# Altium project ENCE461Tutorial.PrjPcb
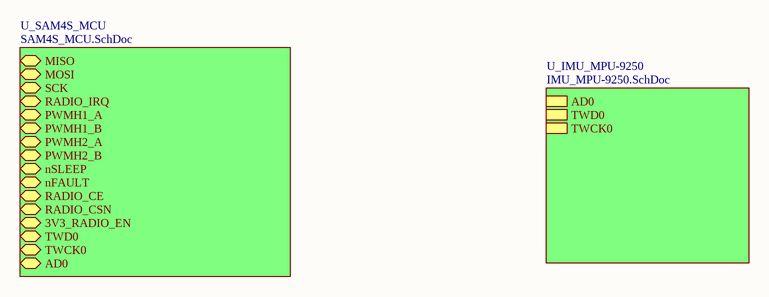
[diagram p0: Hat_Top_Level.SchDoc]
7 sheets, 101 parts. Net scope: hierarchical (ports join the sheet entries above them; power ports are global).
Sheets:
  Hat_Top_Level.SchDoc
    U_SAM4S_MCU = SAM4S_MCU.SchDoc
    U_IMU_MPU-9250 = IMU_MPU-9250.SchDoc
  Battery_and_Power.SchDoc
  Motor_Drivers.SchDoc
  Radio.SchDoc
  Joystick.SchDoc

## Sheet Hat_Top_Level.SchDoc
size A3; Address1: ECE Department; Address2: University of Canterbury; Address3: Christchurch 8041; Address4: New Zealand; Revision: 1

### Sub-sheets
U_IMU_MPU-9250 = IMU_MPU-9250.SchDoc: AD0, TWD0, TWCK0
U_SAM4S_MCU = SAM4S_MCU.SchDoc: MISO (bidir), MOSI (bidir), SCK (bidir), RADIO_IRQ (bidir), PWMH1_A (bidir), PWMH1_B (bidir), PWMH2_A (bidir), PWMH2_B (bidir), nSLEEP (bidir), nFAULT (bidir), RADIO_CE (bidir), RADIO_CSN (bidir), 3V3_RADIO_EN (bidir), TWD0 (bidir), TWCK0 (bidir), AD0 (bidir)

### Notes on the sheet
- Title
- Drawn by:
- Date:
- Time:
- Revision:
- Sheet
- of
- File:

## Sheet SAM4S_MCU.SchDoc: Wacky2020 AD19 HAT test
size A3; DrawnBy: Group 19; Address1: ECE Department; Address2: University of Canterbury; Address3: Christchurch 8041; Address4: New Zealand; Revision: 1
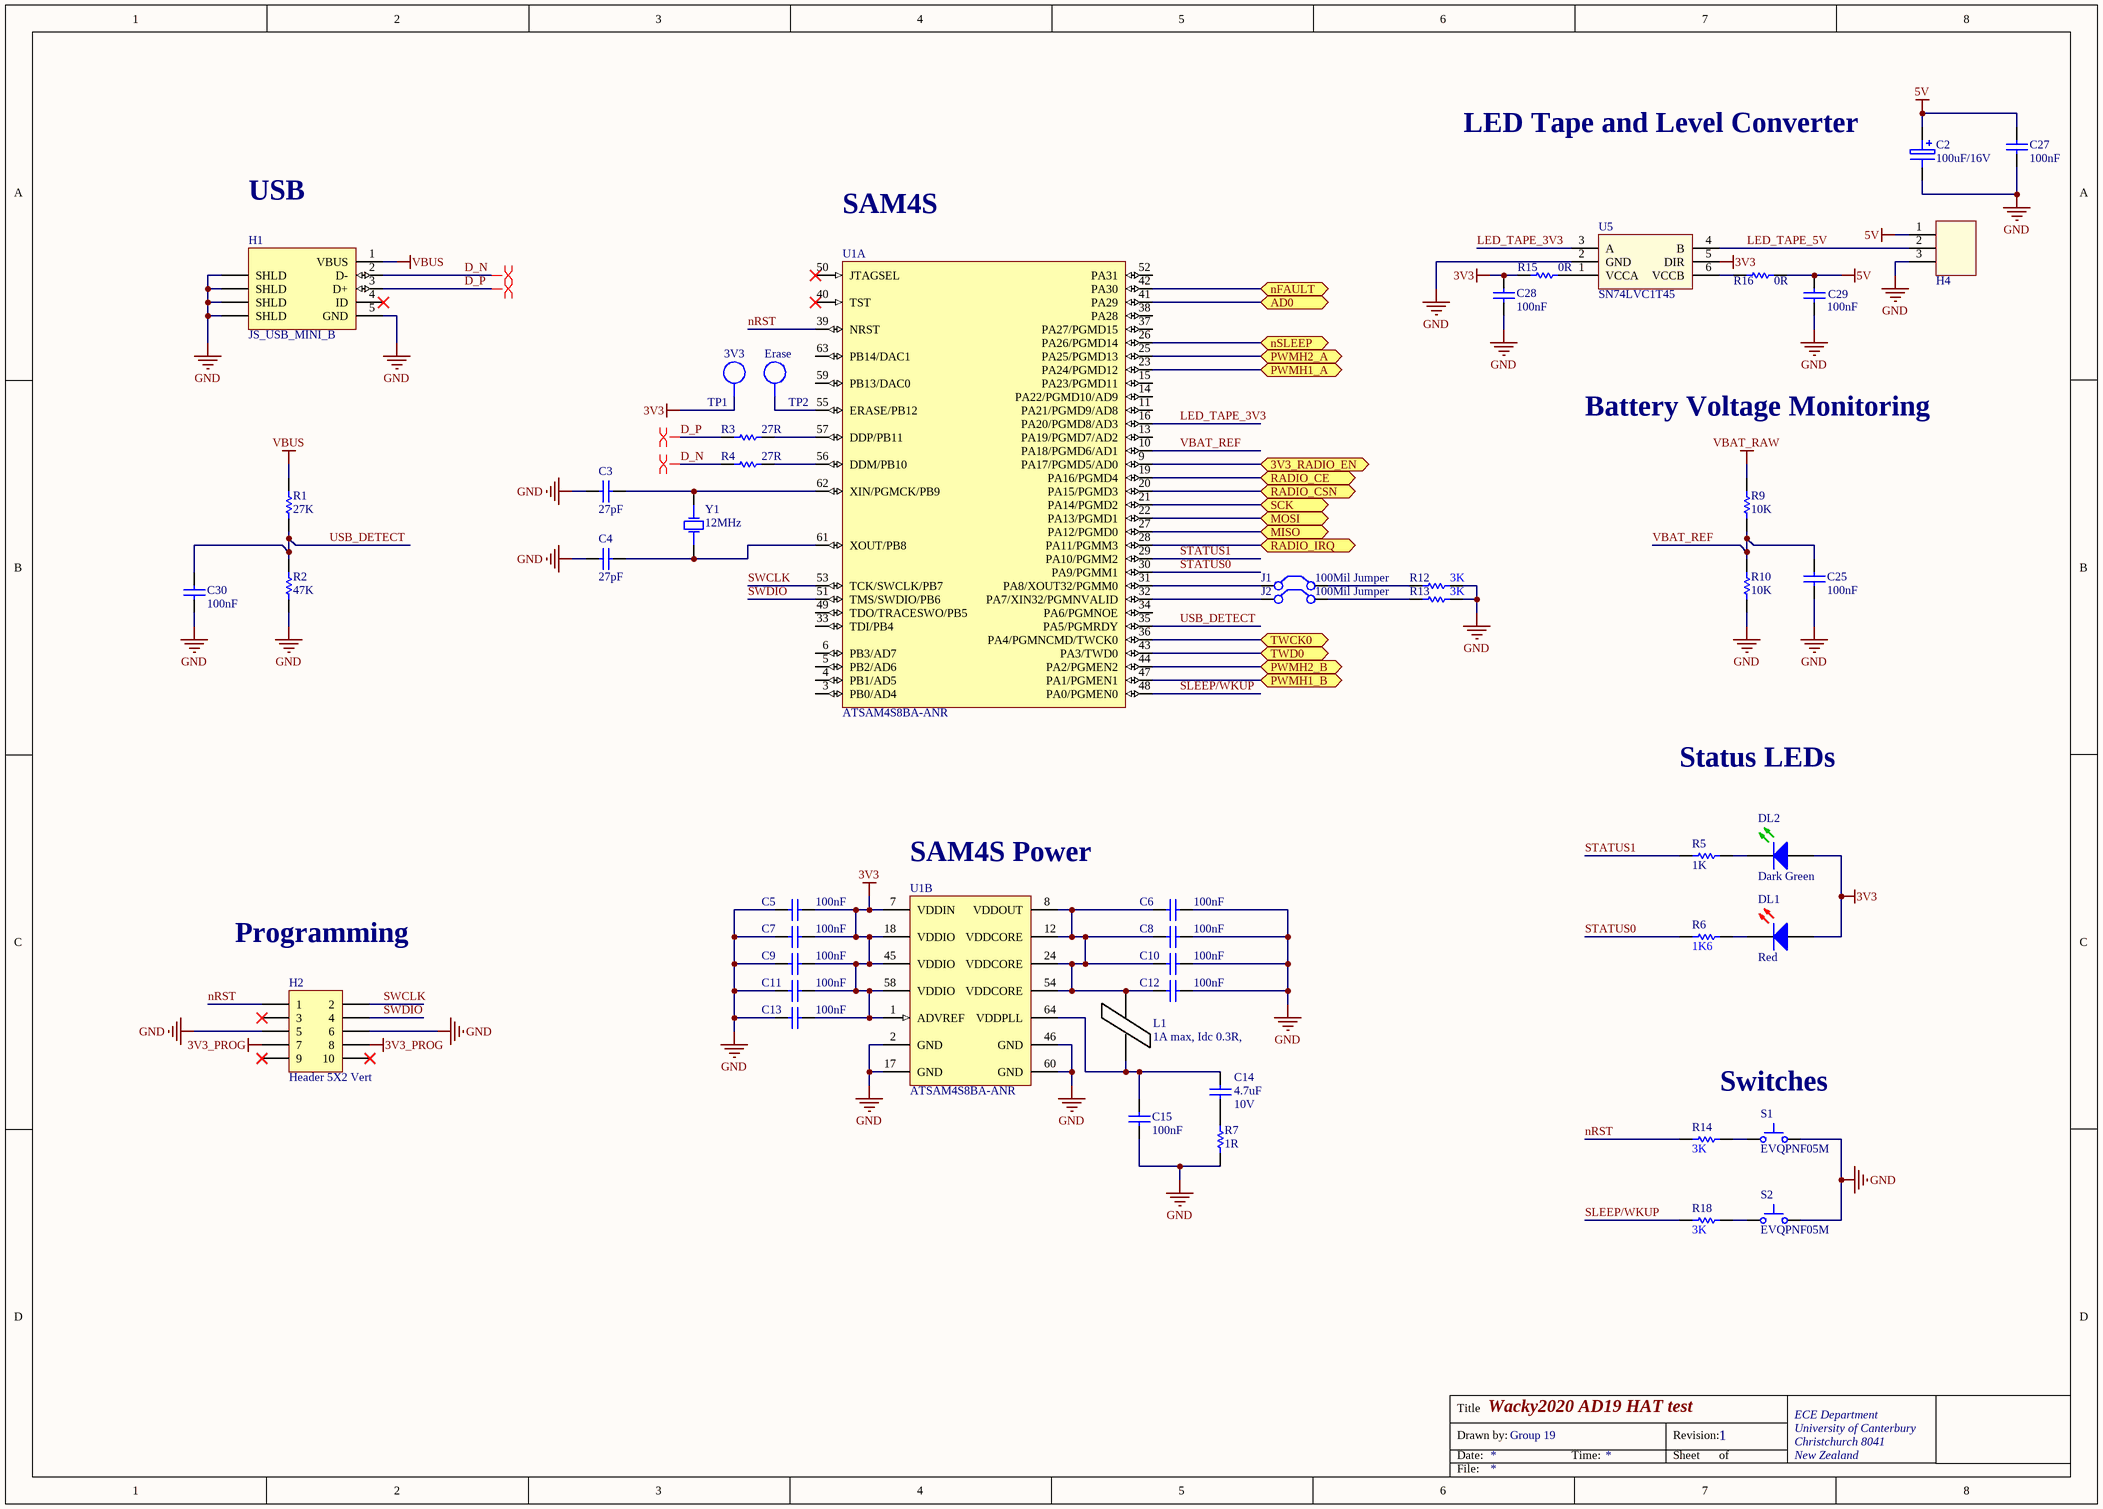
[diagram p1: SAM4S_MCU.SchDoc]

### Parts
C2  100uF/16V  [NICH-1]
C3  27pF  [CAPC1608L]
C4  27pF  [CAPC1608L]
C5  100nF  [CAPC1608L]
C6  100nF  [CAPC1608L]
C7  100nF  [CAPC1608L]
C8  100nF  [CAPC1608L]
C9  100nF  [CAPC1608L]
C10  100nF  [CAPC1608L]
C11  100nF  [CAPC1608L]
C12  100nF  [CAPC1608L]
C13  100nF  [CAPC1608L]
C14  Max Voltage: 10V  [CAPC1608N]  (hidden comment: 4.7uF)
C15  100nF  [CAPC1608L]
C25  100nF  [CAPC1608L]
C27  100nF  [CAPC1608L]
C28  100nF  [CAPC1608L]
C29  100nF  [CAPC1608L]
C30  100nF  [CAPC1608L]
DL1  Red  [WL-SMCW0603]
DL2  Dark Green  [WL-SMCW0603]
H1  JS_USB_MINI_B  [USB/SM0.8-6H5]
H2  Header 5X2 Vert  [IDC2.54-V10D]
H4  HEADER_3  [HEADER_3POS]  (value not drawn)
J1  100Mil Jumper  [JMP2.54]
J2  100Mil Jumper  [JMP2.54]
L1  1A max, Idc 0.3R,  [INDC3216L]
R1  27K  [RESC1608L]
R2  47K  [RESC1608N]
R3  27R  [RESC1608L]
R4  27R  [RESC1608L]
R5  1K  [RESC1608L]
R6  1K6  [RESC1608L]
R7  1R  [RESC3216L]
R9  10K  [RESC1608L]
R10  10K  [RESC1608L]
R12  3K  [RESC1608L]
R13  3K  [RESC1608L]
R14  3K  [RESC1608L]
R15  0R  [RESC1608L]
R16  0R  [RESC1608L]
R18  3K  [RESC1608L]
S1  EVQPNF05M  [EVQPNF05M]
S2  EVQPNF05M  [EVQPNF05M]
TP1  3V3  [TP_1206]  (no BOM)
TP2  Erase  [TP_1206]  (no BOM)
U1  ATSAM4S8BA-ANR  [LQFP64_L]  (parts A,B of 2)
U5  SN74LVC1T45  [SOT23-6_N]
Y1  12MHz  [6.0X3.5-4]

### Ports
3V3_RADIO_EN (bidir), AD0 (bidir), MISO (bidir), MOSI (bidir), nFAULT (bidir), nSLEEP (bidir), PWMH1_A (bidir), PWMH1_B (bidir), PWMH2_A (bidir), PWMH2_B (bidir), RADIO_CE (bidir), RADIO_CSN (bidir), RADIO_IRQ (bidir), SCK (bidir), TWCK0 (bidir), TWD0 (bidir)

### Nets
3V3: C5.2 C7.2 C9.2 C11.2 C13.2 C28.2 DL1.2(A) DL2.2(A) R15.1 TP1.1 U1.1(ADVREF) U1.7(VDDIN) U1.18(VDDIO) U1.45(VDDIO) U1.58(VDDIO) U5.5(DIR)
3V3_PROG: H2.7 H2.8
5V: C2.2 C27.2 C29.2 H4.1 R16.2
GND: C2.1 C3.1 C4.1 C5.1 C6.2 C7.1 C8.2 C9.1 C10.2 C11.1 C12.2 C13.1 C15.2 C25.1 C27.1 C28.1 C29.1 C30.1 H1.5(GND) H1.6(SHLD) H1.7(SHLD) H1.8(SHLD) H1.9(SHLD) H2.5 H2.6 H4.3 R2.1 R7.1 R10.1 R12.2 R13.2 S1.1 S2.1 U1.2(GND) U1.17(GND) U1.46(GND) U1.60(GND) U5.2(GND)
VBAT_RAW: R9.2
VBUS: H1.1(VBUS) R1.2
D_N: H1.2(D-) R4.1
D_P: H1.3(D+) R3.1
LED_TAPE_3V3: U1.16(PA20/PGMD8/AD3) U5.3(A)
LED_TAPE_5V: H4.2 U5.4(B)
nRST: H2.1 R14.1 U1.39(NRST)
SLEEP/WKUP: R18.1 U1.48(PA0/PGMEN0)
STATUS0: R6.1 U1.30(PA9/PGMM1)
STATUS1: R5.1 U1.29(PA10/PGMM2)
SWCLK: H2.2 U1.53(TCK/SWCLK/PB7)
SWDIO: H2.4 U1.51(TMS/SWDIO/PB6)
USB_DETECT: C30.2 R1.1 R2.2 U1.35(PA5/PGMRDY)
VBAT_REF: C25.2 R9.1 R10.2 U1.10(PA18/PGMD6/AD1)
NetC3_2: C3.2 U1.62(XIN/PGMCK/PB9) Y1.3(OSC2)
NetC4_2: C4.2 U1.61(XOUT/PB8) Y1.1(OSC1)
NetC6_1: C6.1 C8.1 C10.1 C12.1 L1.2 U1.8(VDDOUT) U1.12(VDDCORE) U1.24(VDDCORE) U1.54(VDDCORE)
NetC14_1: C14.1 R7.2
NetC14_2: C14.2 C15.1 L1.1 U1.64(VDDPLL)
NetDL1_1: DL1.1(K) R6.2
NetDL2_1: DL2.1(K) R5.2
NetJ1_1: J1.1(C1) U1.31(PA8/XOUT32/PGMM0)
NetJ1_2: J1.2(C2) R12.1
NetJ2_1: J2.1(C1) U1.32(PA7/XIN32/PGMNVALID)
NetJ2_2: J2.2(C2) R13.1
NetR3_2: R3.2 U1.57(DDP/PB11)
NetR4_2: R4.2 U1.56(DDM/PB10)
NetR14_2: R14.2 S1.2
NetR15_2: R15.2 U5.1(VCCA)
NetR16_1: R16.1 U5.6(VCCB)
NetR18_2: R18.2 S2.2
NetTP2_1: TP2.1 U1.55(ERASE/PB12)
NetU1_9: U1.9(PA17/PGMD5/AD0) ; port 3V3_RADIO_EN
NetU1_19: U1.19(PA16/PGMD4) ; port RADIO_CE
NetU1_20: U1.20(PA15/PGMD3) ; port RADIO_CSN
NetU1_21: U1.21(PA14/PGMD2) ; port SCK
NetU1_22: U1.22(PA13/PGMD1) ; port MOSI
NetU1_23: U1.23(PA24/PGMD12) ; port PWMH1_A
NetU1_25: U1.25(PA25/PGMD13) ; port PWMH2_A
NetU1_26: U1.26(PA26/PGMD14) ; port nSLEEP
NetU1_27: U1.27(PA12/PGMD0) ; port MISO
NetU1_28: U1.28(PA11/PGMM3) ; port RADIO_IRQ
NetU1_36: U1.36(PA4/PGMNCMD/TWCK0) ; port TWCK0
NetU1_41: U1.41(PA29) ; port AD0
NetU1_42: U1.42(PA30) ; port nFAULT
NetU1_43: U1.43(PA3/TWD0) ; port TWD0
NetU1_44: U1.44(PA2/PGMEN2) ; port PWMH2_B
NetU1_47: U1.47(PA1/PGMEN1) ; port PWMH1_B

Not connected (* = marked no-connect by the designer): H1 4(ID)*; H2 3* 9* 10*; U1 3(PB0/AD4) 4(PB1/AD5) 5(PB2/AD6) 6(PB3/AD7) 11(PA21/PGMD9/AD8) 13(PA19/PGMD7/AD2) 14(PA22/PGMD10/AD9) 15(PA23/PGMD11) 33(TDI/PB4) 34(PA6/PGMNOE) 37(PA27/PGMD15) 38(PA28) 40(TST)* 49(TDO/TRACESWO/PB5) 50(JTAGSEL)* 52(PA31) 59(PB13/DAC0) 63(PB14/DAC1)

### Layout directives
differential pair: D_N, D_P

### Notes on the sheet
- (near C2) LED Tape and Level Converter
- USB
- SAM4S
- Battery Voltage Monitoring
- Status LEDs
- (near U1) SAM4S Power
- Programming
- Switches
- Title
- Drawn by:
- Date:
- Time:
- Revision:
- Sheet
- of
- File:

### Library data of the parts
C2 = CA_100uF_16V: CAP ALUM 100uF 16V SMD; Manufacturer PN: UWX1C101MCL1GB; Manufacturer: Nichcon; Supplier 1: Farnell; Supplier Part Number 1: 1870677; Storage Location: PCB Assembly WS; Supplier: ECE Dept; Supplier 2: Digi-Key; Supplier Part Number 2: 493-2105-1-ND; Value: 100uF/16V
C3 C4 = CC_27pF_0603: CAP CER 27pF NPO/COG +-5% 50V 0603; PackageReference: 0603; Code_IPC: 1608 [0603]; Verify: *; Supplier: ECE Dept; Storage Location: PCB Assembly WS; Value: 27pF
C5-C13 C15 C25 C27-C30 = CC_100nF_0603: CAP CER 100nF X7R +-10% 50V 0603; PackageReference: 0603; Code_IPC: 1608 [0603]; Verify: *; Supplier: ECE Dept; Storage Location: PCB Assembly WS; Value: 100nF
C14 = CC_4.7uF_0603: CAP CER 4.7uF X5R +-20%  10V 0603; Note: Footprint corresponds to dimensions for bulk cassette packaging. This case size has tightened tolerances.; PackageReference: 0805; Code_IPC: 2012[0805]; Verify: *; Supplier: ECE Dept; Storage Location: PCB Assembly WS; Value: 4.7uF
DL1 = DL_150060RS75000: LED Red 250mcd 0603 SMD; Manufacturer: WURTH ELEKTRONIK; Forward Current If: 30; Forward Voltage: 2; Lens Shape: Rectangular; Luminous Intensity: 250; Wavelength Typ: 625; Viewing Angle: 140°; LED Mounting: SMD; Supplier 1: Farnell; Supplier Part Number 1: 2322071; Manufacturer Part Number: 150060RS75000; Storage Location: PCB Assembly WS; Supplier: ECE Dept; LED Colour: Red
DL2 = DL_150060GS75000: LED Dk Green 430mcd 0603 SMD; Manufacturer: WURTH ELEKTRONIK; Forward Current If: 30; Wavelength Typ: 520; Forward Voltage: 3.2; Lens Shape: Rectangular; Luminous Intensity: 430; Viewing Angle: 140°; LED Mounting: SMD; Supplier 1: Farnell; Supplier Part Number 1: 2322070; Manufacturer Part Number: 150060GS75000; Storage Location: PCB Assembly WS; Supplier: ECE Dept; LED Colour: Dark Green
H1 = JS_USB_MINI_B_SMT: USB 2.0, Right Angle, SMT, B Type, Receptacle, 5 Position,; Manufacturer: FCI; Manufacturer PN: 10033526-N3212MLF; Supplier 1: Farnell; Supplier Part Number 1: 1824416; Storage Location: PCB Assembly WS; Supplier: ECE Dept
H2 = JA_HDR_IDC_5X2_VERT: IDC Header, 2,54mm, 10-Pin, Vert; Supplier: ECE Dept; Supplier 1: Farnell; Supplier Part Number 1: 1096985; Storage Location: ECE Dept Store
H4 = HEADER_3: 3Pin Header 2.54mm spacing
J1 J2 = TP_JUMPER: 2.54mm Jumper Thru Hole; Pitch Spacing: 2.54; No. of Rows: 1; No. of Positions: 2; Supplier: ECE Dept; Supplier 1: Farnell; Supplier Part Number 1: 1097975; Storage Location: ECE$ Store
L1 = IN_Ferrite-Bead: Ferrite Bead, Rdc 0.3R, Z100MHZ 600R, Imax 1A, SMD 1206; Manufacturer: FAIR-RITE; Manufacturer PN: 2512066017Y1; DC Current Rating: 1; DC Resistance Max: 0.08; Ferrite Case Style: 1206 ^3216 Metric]; Frequency Range: 50MHz to 1; Impedance: 600; Impedance Tolerance: ± 25%; Supplier: ECE Dept; Storage Location: PCB Assembly WS; Ferrite Mounting: SMD; Supplier 1: Farnell; Supplier Part Number 1: 1612060; Manufacturer Part Number: 2512066017Y1; Value: 1A max, Idc 0.3R,
R1 = RS_27K: RES 27K OHM 1/10W 5% 0603 SMD; Storage Location: PCB Assembly WS; Supplier: ECE Dept; Value: 27K
R2 = RS_47K: RES 47.0K OHM 1/10W 5% 0603 SMD; Storage Location: PCB Assembly WS; Supplier: ECE Dept; Value: 47K
R3 R4 = RS_27R: RES 27 OHM 1/10W 5% 0603 SMD; Storage Location: PCB Assembly WS; Supplier: ECE Dept; Value: 27R
R5 = RS_1K: RES 1.0K OHM 1/10W 5% 0603 SMD; Storage Location: PCB Assembly WS; Supplier: ECE Dept; Value: 1K
R6 = RS_1K6: RES 1.6K OHM 1/10W 5% 0603 SMD; Storage Location: PCB Assembly WS; Supplier: ECE Dept; Value: 1K6
R7 = RT_1R: RES 1R OHM 1/4W 5% 1206 SMD; Storage Location: PCB Assembly WS; Supplier: ECE Dept; Value: 1R
R9 R10 = RS_10K: RES 10.0K OHM 1/10W 5% 0603 SMD; Storage Location: PCB Assembly WS; Supplier: ECE Dept; Value: 10K
R12-R14 R18 = RS_3K: RES 3K OHM 1/10W 5% 0603 SMD; Storage Location: PCB Assembly WS; Supplier: ECE Dept; Value: 3K
R15 R16 = RS_0R0: RES 0.0 OHM 1/10W 5% 0603 SMD; Storage Location: PCB Assembly WS; Supplier: ECE Dept; Value: 0R
S1 S2 = WS_EVQPNF05M: Panasonic 6 x 3.5mm SMD Light Touch Switch Type SMD; PackageDescription: 6.0 x 3.5 mm; Supplier 1: Farnell; Supplier Part Number 1: 2079481; Manufacturer: Panasonic; Manufacturer PN: EVQPNF05M; Supplier 2: Digi-Key; Supplier Part Number 2: P13598SCT-ND; Storage Location: PCB Assembly WS; Supplier: ECE Dept
TP1 TP2 = TP_1206: Test-Point 3.3x1.6x2.1mm SMD; Manufacturer: Harwin Inc; Manufacturer Part Number: S1751-46R; Value: TP; Manufacturer PN: *; Storage Location: ProtoPlace; Mounting Type: Surface Mount; Type: PC Test Point; Supplier 1: Digi-Key; Supplier Part Number 1: 952-1478-2-ND; Supplier 2: Farnell; Supplier Part Number 2: 1826282; Supplier: ECE Dept
U1 = SE_ATSAM4S16BA-MU: IC MCU 32BIT 512KB FLASH 64LQFP; Manufacturer: Atmel; Connectivity: I²C, IrDA, Memory Card, SPI, SSC, UART/USART, USB; Core Processor: ARM® Cortex®-M4; Core Size: 32-Bit; Data Converters: A/D 11x12b, D/A 2x12b; Number of I/O: 47; Peripherals: Brown-out Detect/Reset, DMA, POR, PWM, WDT; Program Memory Size: 512KB (512K x 8); RAM Size: 128K x 8; Speed: 120MHz; Voltage - Supply (Vcc/Vdd): 1.62 V ~ 3.6 V; PackageVersion: revJ, Jul-2007; PackageReference: 64PS; PackageDescription: 64-Pin Quad Flat No-Lead (QFN) Sawn, 9 x 9 x 1.0 mm Body, 0.5 mm Pitch, Exposed Pad; Code_JEDEC: MO-220VMMD-3; ComponentLink1Description: Manufacturer URL; ComponentLink1URL: http://www.atmel.com/; ComponentLink2Description: SAM4S Series Datasheet; ComponentLink2URL: http://www.atmel.com/dyn/resources/prod_documents/11100.pdf; ComponentLink3Description: SAM4S Series Summary; ComponentLink3URL: http://www.atmel.com/dyn/resources/prod_documents/11100S.pdf; Supplier 1: Digi-Key; Package / Case: 64-LQFP; Packaging: Cut Tape (CT); Program Memory Type: FLASH; Supplier Part Number 1: ATSAM4S8BA-ANRCT-ND; Manufacturer Part Number: ATSAM4S8BA-ANR
U5 = SN74LVC1T45: 1.8V - 5V level converter
Y1 = XT_CRYSTAL_12MHz_18pF: CRYSTAL 12MHZ 18PF 6X3.5mm SMD; Manufacturer: CTS-Frequency Controls; Manufacturer Part Number: 406C35D12M00000; ESR (Equivalent Series Resistance): 60 Ohm; Frequency Stability: ±50ppm; Frequency Tolerance: ±30ppm; Operating Mode: Fundamental; Supplier 1: Digi-Key; Height: 0.047" (1.20mm); Load Capacitance: 18pF; Mounting Type: Surface Mount; Operating Temperature: -20°C ~ 70°C; Package / Case: 4-SMD, No Lead (DFN, LCC); Size / Dimension: 0.236" L x 0.138" W (6.00mm x 3.50mm); Supplier Part Number 1: CTX855CT-ND; Frequency: 12MHz

## Sheet IMU_MPU-9250.SchDoc
size A3; Author: Group 19; Address1: ECE Department; Address2: University of Canterbury; Address3: Christchurch 8041; Address4: New Zealand; Revision: 1
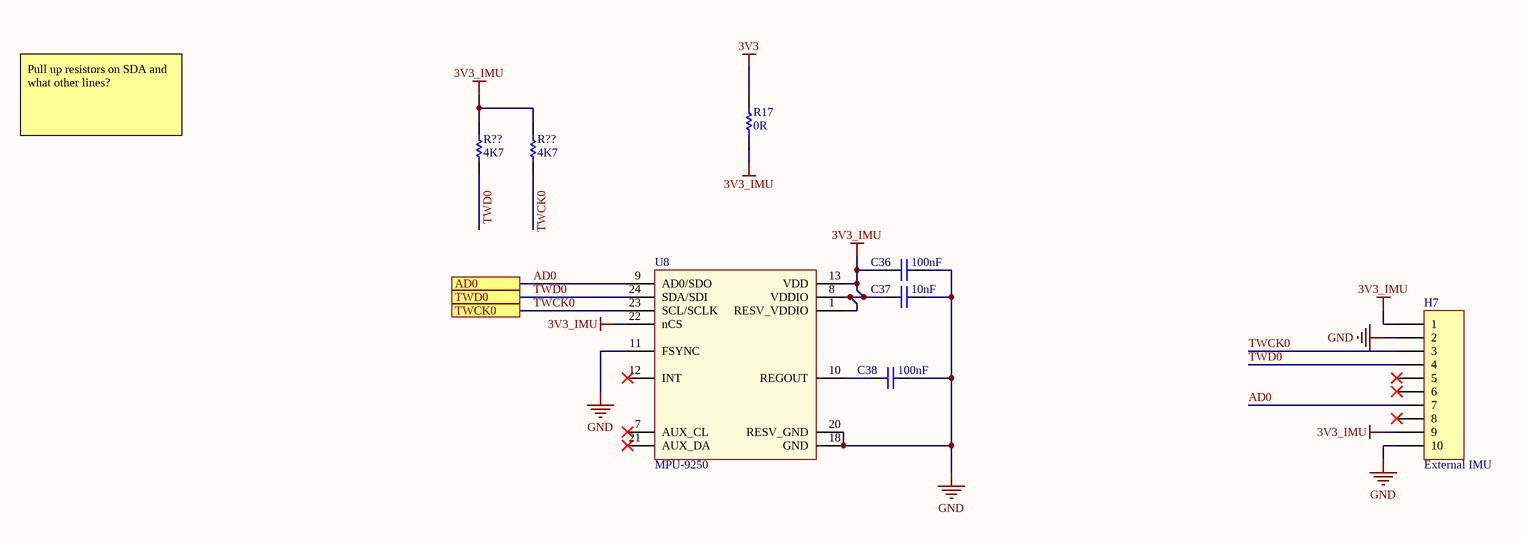
[diagram p2: IMU_MPU-9250.SchDoc]

### Parts
(Parts that share a designator on the sheet are numbered #1, #2 ... from top to bottom, then left to right.)
C36  100nF  [CAPC1608L]
C37  10nF  [CAPC1608L]
C38  100nF  [CAPC1608L]
H7  External IMU  [MOLEX_KK_10_HDR]
R17  0R  [RESC1608L]
R??#1  4K7  [RESC1608L]
R??#2  4K7  [RESC1608L]
U8  MPU-9250  [Quad24]

### Ports
AD0, TWCK0, TWD0

### Nets
3V3: R17.2
3V3_IMU: C36.1 C37.1 H7.1 H7.9 R17.1 R??#1.2 R??#2.2 U8.1(RESV_VDDIO) U8.8(VDDIO) U8.13(VDD) U8.22(nCS)
GND: C36.2 C37.2 C38.1 H7.2 H7.10 U8.11(FSYNC) U8.18(GND) U8.20(RESV_GND)
AD0: H7.7 U8.9(AD0/SDO) ; port AD0
TWCK0: H7.3 R??#2.1 U8.23(SCL/SCLK) ; port TWCK0
TWD0: H7.4 R??#1.1 U8.24(SDA/SDI) ; port TWD0
NetC38_2: C38.2 U8.10(REGOUT)

Not connected (* = marked no-connect by the designer): H7 5* 6* 8*; U8 7(AUX_CL)* 12(INT)* 21(AUX_DA)*

### Notes on the sheet
- Pull up resistors on SDA and what other lines?
- Title
- Drawn by:
- Date:
- Time:
- Revision:
- Sheet
- of
- File:

### Library data of the parts
C36 C38 = CC_100nF_0603: CAP CER 100nF X7R +-10% 50V 0603; PackageReference: 0603; Code_IPC: 1608 [0603]; Verify: *; Supplier: ECE Dept; Storage Location: PCB Assembly WS; Value: 100nF
C37 = CC_10nF_0603: CAP CER 10nF X7R +-10% 50V 0603; PackageReference: 0603; Code_IPC: 1608 [0603]; Verify: *; Supplier: ECE Dept; Storage Location: PCB Assembly WS; Value: 10nF
H7 = JA_MOLEX_KK_10POS: CONN HEADER 10POS 2.54mm VERT_ Thru Hole; Supplier 1: Farnell; Supplier Part Number 1: 1756828; Supplier: ECE Dept; Storage Location: ECE Dept Store; Value: External IMU
R17 = RS_0R0: RES 0.0 OHM 1/10W 5% 0603 SMD; Storage Location: PCB Assembly WS; Supplier: ECE Dept; Value: 0R
R??#1 R??#2 = RS_4K7: RES 4.7K OHM 1/10W 5% 0603 SMD; Storage Location: PCB Assembly WS; Supplier: ECE Dept; Value: 4K7
U8 = MPU-9250: 9 axis IMU

## Sheet Battery_and_Power.SchDoc
size A3; Address1: ECE Department; Address2: University of Canterbury; Address3: Christchurch 8041; Address4: New Zealand; Revision: 1
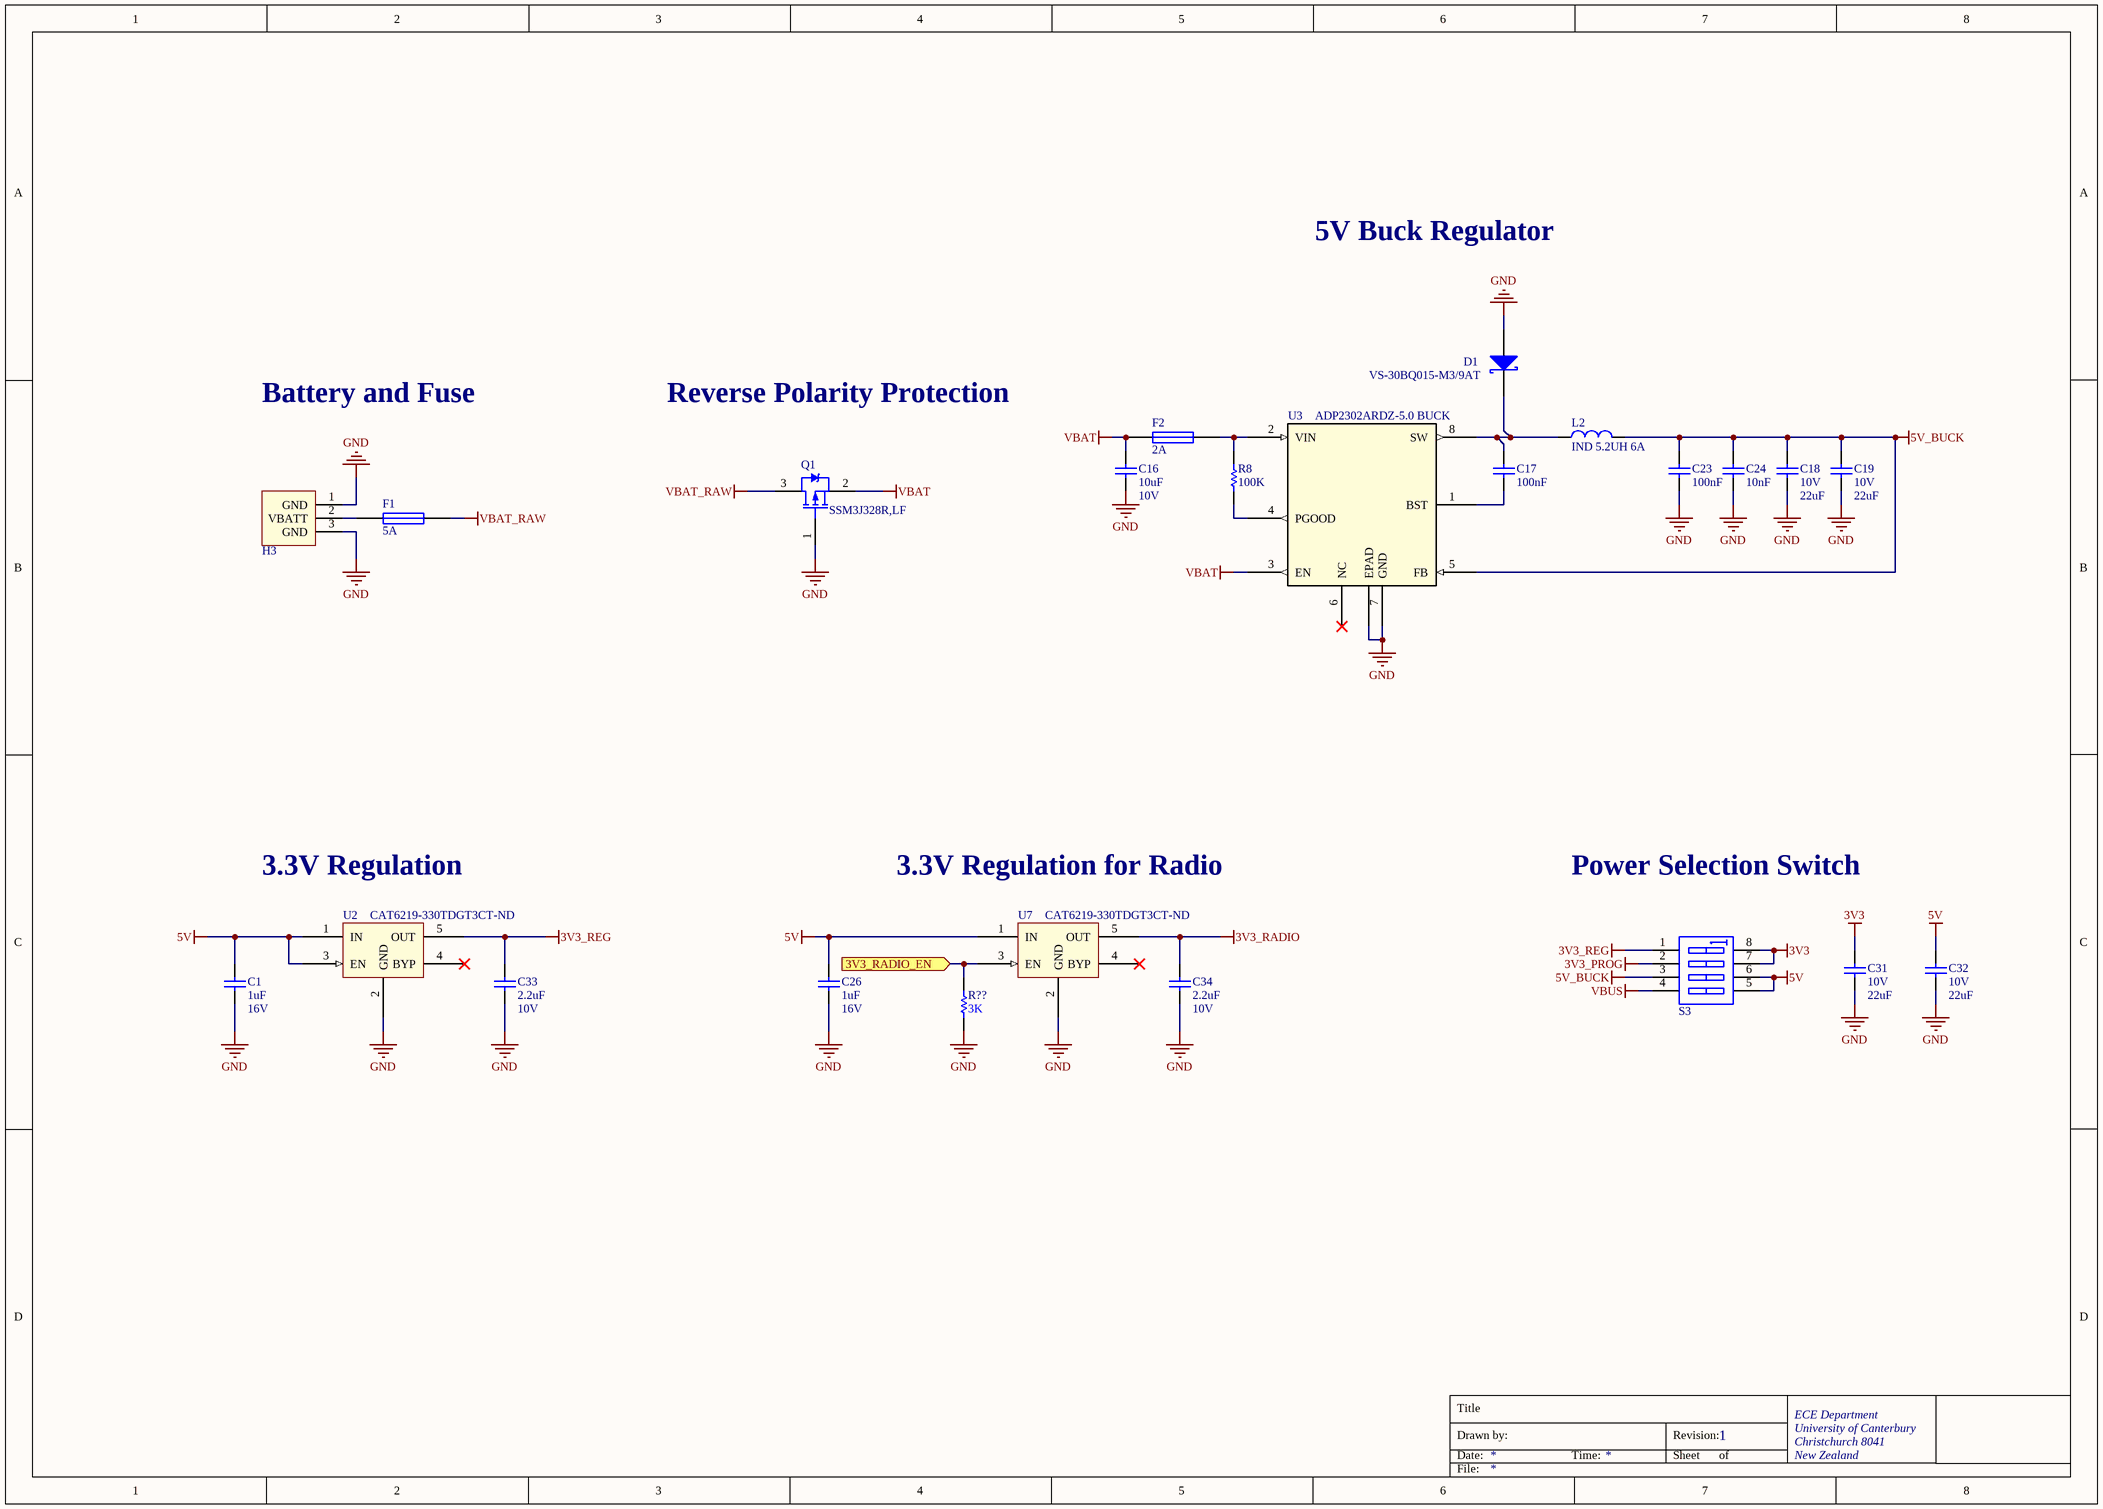
[diagram p3: Battery_and_Power.SchDoc]

### Parts
(Parts that share a designator on the sheet are numbered #1, #2 ... from top to bottom, then left to right.)
C1  Max Voltage: 16V  [CAPC1608L]  (hidden comment: 1uF)
C16  Max Voltage: 10V  [CAPC2012L]  (hidden comment: 10uF)
C17  100nF  [CAPC1608L]
C18  Max Voltage: 10V  [CAPC3216L]  (hidden comment: 22uF)
C19  Max Voltage: 10V  [CAPC3216L]  (hidden comment: 22uF)
C23  100nF  [CAPC1608L]
C24  10nF  [CAPC1608L]
C26  Max Voltage: 16V  [CAPC1608L]  (hidden comment: 1uF)
C31  Max Voltage: 10V  [CAPC3216L]  (hidden comment: 22uF)
C32  Max Voltage: 10V  [CAPC3216L]  (hidden comment: 22uF)
C33  Max Voltage: 10V  [CAPC1608L]  (hidden comment: 2.2uF)
C34  Max Voltage: 10V  [CAPC1608L]  (hidden comment: 2.2uF)
D1  VS-30BQ015-M3/9AT  [SMC]
F1  5A  [RESC3216N]
F2  2A  [RESC3216N]
H3  Battery_HEADER_3pin  [BATT_HEADER_3POS]  (value not drawn)
L2  IND 5.2UH 6A  [INDUCTOR5u2]
Q1  SSM3J328R,LF  [SOT23_L]
R8  100K  [RESC1608L]
R??#3  3K  [RESC1608L]
S3  WS_SW DIP-4  [DIP_SW_4WAY_SMD -]  (value not drawn)
U2  Supplier Part Number: CAT6219-330TDGT3CT-ND  [SOT95P280X145-5N]  (hidden comment: CAT6219-330TDGT3)
U3  ADP2302ARDZ-5.0 BUCK  [RD_8_1]
U7  Supplier Part Number: CAT6219-330TDGT3CT-ND  [SOT95P280X145-5N]  (hidden comment: CAT6219-330TDGT3)

### Ports
3V3_RADIO_EN (in)

### Nets
3V3: C31.2 S3.7(B2) S3.8(B1)
3V3_PROG: S3.2(A2)
3V3_RADIO: C34.2 U7.5(OUT)
3V3_REG: C33.2 S3.1(A1) U2.5(OUT)
5V: C1.2 C26.2 C32.2 S3.5(B4) S3.6(B3) U2.1(IN) U2.3(EN) U7.1(IN)
5V_BUCK: C18.2 C19.2 C23.2 C24.2 L2.2 S3.3(A3) U3.5(FB)
GND: C1.1 C16.1 C18.1 C19.1 C23.1 C24.1 C26.1 C31.1 C32.1 C33.1 C34.1 D1.1(A) H3.1(GND) H3.3(GND) Q1.1 R??#3.1 U2.2(GND) U3.7(GND) U3.EPAD U7.2(GND)
VBAT: C16.2 F2.1 Q1.2 U3.3(EN)
VBAT_RAW: F1.2 Q1.3
VBUS: S3.4(A4)
NetC17_1: C17.1 U3.1(BST)
NetC17_2: C17.2 D1.2(K) L2.1 U3.8(SW)
NetF1_1: F1.1 H3.2(VBATT)
NetF2_2: F2.2 R8.2 U3.2(VIN)
NetR8_1: R8.1 U3.4(PGOOD)
NetR??#3_2: R??#3.2 U7.3(EN) ; port 3V3_RADIO_EN

Not connected (* = marked no-connect by the designer): U2 4(BYP)*; U3 6(NC)*; U7 4(BYP)*

### Notes on the sheet
- 5V Buck Regulator
- Battery and Fuse
- Reverse Polarity Protection
- 3.3V Regulation
- 3.3V Regulation for Radio
- Power Selection Switch
- Title
- Drawn by:
- Date:
- Time:
- Revision:
- Sheet
- of
- File:

### Library data of the parts
C1 C26 = CC_1uF_0603: CAP CER 1uF Y5V -20% +80% 16V 0603; PackageReference: 0603; Code_IPC: 1608 [0603]; Verify: *; Supplier: ECE Dept; Storage Location: PCB Assembly WS; Value: 1uF
C16 = CC_10uF_0805_10V: CAP CER 10uF X7R +-20% 10V 0805; Note: Footprint corresponds to dimensions for bulk cassette packaging. This case size has tightened tolerances.; PackageReference: 0805; Code_IPC: 2012[0805]; Verify: *; Supplier: ECE Dept; Storage Location: PCB Assembly WS; Value: 10uF
C17 C23 = CC_100nF_0603: CAP CER 100nF X7R +-10% 50V 0603; PackageReference: 0603; Code_IPC: 1608 [0603]; Verify: *; Supplier: ECE Dept; Storage Location: PCB Assembly WS; Value: 100nF
C18 C19 C31 C32 = CC_22uF_1206: CAP CER 22uF Y5V -20% +80% 10V 1206; Verify: *; Supplier: ECE Dept; Storage Location: PCB Assembly WS; Dielectric: Y5V; Footprint: 1206 (3216 metric); Value: 22uF
C24 = CC_10nF_0603: CAP CER 10nF X7R +-10% 50V 0603; PackageReference: 0603; Code_IPC: 1608 [0603]; Verify: *; Supplier: ECE Dept; Storage Location: PCB Assembly WS; Value: 10nF
C33 C34 = CC_2.2uF_0603: CAP CER 2.2uF X5R +-20% 10V 0603; PackageReference: 0603; Code_IPC: 1608 [0603]; Verify: *; Supplier: ECE Dept; Storage Location: PCB Assembly WS; Value: 2.2uF
D1 = DS_VS-30BQ015-M3: DIODE, SCHOTTKY, 3A, 15V, DO-214AB / SMC; Manufacturer: Vishay Semiconductors; Forward Voltage: 350mV; Max Forward Surge Current (Ifsm): 650A; Peak Reverse Current: 4mA; Average Rectified Current: 3A; Max Reverse Voltage (DC): 15V; Supplier: Digi-Key; ComponentLink1URL: https://datasheet.ciiva.com/36181/vs-30bq015-m3-9at-36181258.pdf; ComponentLink1Description: https://datasheet.ciiva.com/36181/vs-30bq015-m3-9at-36181258.pdf; Supplier 1: Digi-Key; Supplier 2: Element14; Supplier Part Number 1: VS-30BQ015-M3/9ATGIDKR-ND; Supplier Part Number 2: 2628288; Supplier Part Number: VS-30BQ015-M3/9AT-ND; Manufacturer Part Number: VS-30BQ015-M3/9AT
F1 = FS_Fuse_5.0A: Fuse 5.0A Fast Acting 1206 SMD; Manufacturer Part Number: C1F5; Manufacturer: Bel TRP; Voltage Rating (AC): 125V; Voltage Rating (DC): 63V; DC Cold Resistance: 19mR; Fuse Type: Board Mount (Cartridge Style Excluded); Approvals: CE,cURus; Mount: Surface Mount; Case/Package: 1206; Number of Pins: 2; Case Code (Metric): 3216; Case Code (Imperial): 1206; Contact Plating: Nickel,Tin; Min Operating Temperature: -55°C; Max Operating Temperature: 125°C; Packaging: Tape and Reel; Voltage Rating: 125V; Length: 0.126inch; Width: 0.062inch; Supplier 1: Digi-Key; Stock 1: 725; Pricing 1: 1=0.32, 5=0.312, 10=0.298, 50=0.2662, 100=0.2479, 250=0.22032, 500=0.1836, 1000=0.17442 (USD); ComponentLink1URL: http://www.farnell.com/datasheets/2571625.pdf; ComponentLink1Description: http://www.farnell.com/datasheets/2571625.pdf; ComponentLink2URL: http://belfuse.com/pdfs/C1F.pdf; ComponentLink2Description: http://belfuse.com/pdfs/C1F.pdf; ComponentLink3URL: http://www.mouser.com/ds/2/643/C1F-594910.pdf; ComponentLink3Description: http://www.mouser.com/ds/2/643/C1F-594910.pdf; ComponentLink4URL: https://belfuse.com/resources/StewartConnector/C1F.pdf; ComponentLink4Description: https://belfuse.com/resources/StewartConnector/C1F.pdf; Current Rating: 5A; Supplier Part Number 1: 507-1886-1-ND; Supplier 2: Element14; Supplier Part Number 2: 2848595; Value: 5A
F2 = FS_Fuse_2.0A: Fuse 2.0A Very Fast Acting 1206 SMD; Manufacturer: MULTICOMP; Manufacturer PN: MC12CF 002; Supplier: ECE Dept; Storage Location: PCB Assembly WS; Supplier 1: Farnell; Supplier Part Number 1: 1841029; Manufacturer Part Number: MC12CF 002; Value: 2A
H3 = Battery_HEADER_3pin: 3Pin Header 2.54mm spacing
L2 = CDRH104RNP-5R2NC: FIXED IND 5.2UH 6A 22 MOHM SMD; Manufacturer: Sumida America Components Inc.; Material - Core: Ferrite; Tolerance: ±30%; Current - Saturation: 5.6A; Shielding: Shielded; DC Resistance (DCR): 22 mOhm Max; Supplier 1: Digi-Key; Manufacturer Part Number: CDRH104RNP-5R2NC; RoHS: RoHS Compliant; Category: Inductors, Coils, Chokes; Stock 1: 3849; Pricing 1: 1=2.9, 10=2.678, 100=1.8743, 500=1.5173 (NZD); Packaging: Cut Tape (CT); Part Status: Active; Type: -; Q @ Freq: -; Frequency - Self Resonant: -; Ratings: -; Operating Temperature: -40°C ~ 100°C; Mounting Type: Surface Mount; Package / Case: Nonstandard; Supplier Device Package: -; Size / Dimension: 0.402" L x 0.394" W (10.20mm x 10.00mm); Height - Seated (Max): 0.157" (4.00mm); ComponentLink1URL: http://products.sumida.com/products/pdf/CDRH104R.pdf; ComponentLink1Description: http://products.sumida.com/products/pdf/CDRH104R.pdf; Supplier Part Number 1: 308-2280-1-ND
Q1 = TM_SSM3J328R: MOSFET P-CH 20V 6A SOT23-3; Manufacturer: Toshiba; FET Feature: Logic Level Gate, 1.5V Drive; FET Type: MOSFET P-Channel, Metal Oxide; Gate Charge (Qg) @ Vgs: 12.8nC @ 4.5V; Input Capacitance (Ciss) @ Vds: 840pF @ 10V; Power - Max: 1W; Rds On Max: 29.8mR; Drain to Source Resistance: 47.4mR; Turn-On Delay Time: 32ns; Power Dissipation: 2W; Number of Channels: 1; Turn-Off Delay Time: 107ns; Gate to Source Voltage (Vgs): 8V; Input Capacitance: 840pF; Element Configuration: Single; Drain to Source Breakdown Voltage: -20V; Vgs(th) (Max) @ Id: 1V @ 1mA; Current - Continuous Drain (Id) @ 25° C: 6A; Drain to Source Voltage (Vdss): 20V; Package / Case: SOT-23-3 Flat Leads; Supplier Device Package: SOT-23F; Pricing: 1=0.79, 10=0.658, 25=0.5772, 100=0.4939, 250=0.42836, 500=0.36284, 1000=0.27972 (NZD); Storage Location: PCB Assembly WS; Supplier: Digi-Key; ComponentLink1URL: https://datasheet.ciiva.com/11158/ssm3j328r-datasheet-en-20140301-11158652.pdf; ComponentLink1Description: https://datasheet.ciiva.com/11158/ssm3j328r-datasheet-en-20140301-11158652.pdf; Supplier Part Number: SSM3J328RLFDKR-ND; Max Operating Temperature: 150°C; Mount: Surface Mount; Packaging: Tape and Reel; Min Operating Temperature: -55°C; Continuous Drain Current (ID): 6A; Radiation Hardening: No; Max Power Dissipation: 1W; Package Quantity: 3000; Case/Package: SOT-23-3; Number of Pins: 3; Number of Elements: 1; Supplier 1: Digi-Key; Supplier Part Number 1: SSM3J328RLFDKR-ND; Manufacturer Part Number: SSM3J328R,LF
R8 = RS_100K: RES 100K OHM 1/10W 5% 0603 SMD; Storage Location: PCB Assembly WS; Supplier: ECE Dept; Value: 100K
R??#3 = RS_3K: RES 3K OHM 1/10W 5% 0603 SMD; Storage Location: PCB Assembly WS; Supplier: ECE Dept; Value: 3K
S3 = WS_SW DIP-4: DIP Switch, 4 Position, SPST SMD; Manufacturer: OMRON ELECTRONIC COMPONENTS; Manufacturer Part Number: A6SN-4101; Contact Current DC Max: 25; External Length / Height: 12.1; No. of Switch Positions: 4; Pitch Spacing: 2.54; Contact Configuration: SPST; Supplier 1: Farnell; Supplier Part Number 1: 2029425; Storage Location: PCB Assembly WS; Supplier: ECE Dept
U2 U7 = SV_CAT6219-330TDGT3: IC REG LIN 3.3V 500MA TSOT23-5; Voltage - Input (Max): 5.5V; Voltage Dropout (Max): 0.5V @ 500mA; Manufacturer Part Number: CAT6219-330TDGT3; Base Part Number: CAT6219; Current - Output: 500mA; Package / Case: SOT-23-5 Thin, TSOT-23-5; Supplier: Digi-Key; Supplier Device Package: TSOT-23-5; Voltage - Output (Min/Fixed): 3.3V; ComponentLink1URL: http://www.onsemi.com/pub/Collateral/CAT6219-D.PDF; ComponentLink1Description: http://www.onsemi.com/pub/Collateral/CAT6219-D.PDF; Supplier 1: Digi-Key
U3 = ADP2302ARDZ-5.0-R7: IC REG BUCK 5V 2A 8SOIC; Vendor: Analog Devices Inc; Frequency - Switching: 700kHz; Output Type: Fixed; Voltage - Input (Max): 20V; Manufacturer_Part_Number: ADP2302ARDZ-5.0-R7; Type: DEV; Value: Value; Supplier 1: Digi-Key; Current - Output: 2A; Voltage - Output (Min/Fixed): 5V; Supplier Part Number 1: ADP2302ARDZ-5.0-R7CT-ND

## Sheet Motor_Drivers.SchDoc
size A3; Address1: ECE Department; Address2: University of Canterbury; Address3: Christchurch 8041; Address4: New Zealand; Revision: 1
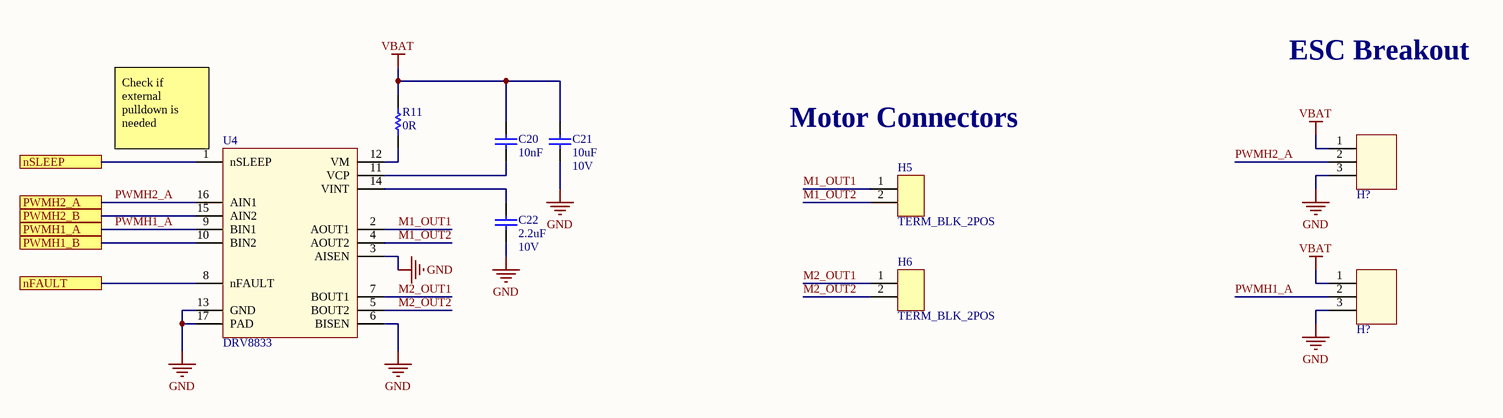
[diagram p4: Motor_Drivers.SchDoc]

### Parts
(Parts that share a designator on the sheet are numbered #1, #2 ... from top to bottom, then left to right.)
C20  10nF  [CAPC1608L]
C21  Max Voltage: 10V  [CAPC2012L]  (hidden comment: 10uF)
C22  Max Voltage: 10V  [CAPC1608L]  (hidden comment: 2.2uF)
H5  TERM_BLK_2POS  [TERM_BLK_2POS]
H6  TERM_BLK_2POS  [TERM_BLK_2POS]
H?#1  HEADER_3  [HEADER_3POS]  (value not drawn)
H?#2  HEADER_3  [HEADER_3POS]  (value not drawn)
R11  0R  [RESC1608L]
U4  DRV8833  [HTSOP16]

### Ports
nFAULT, nSLEEP, PWMH1_A, PWMH1_B, PWMH2_A, PWMH2_B

### Nets
GND: C21.1 C22.1 H?#1.3 H?#2.3 U4.3(AISEN) U4.6(BISEN) U4.13(GND) U4.17(PAD)
VBAT: C20.2 C21.2 H?#1.1 H?#2.1 R11.2
M1_OUT1: H5.1 U4.2(AOUT1)
M1_OUT2: H5.2 U4.4(AOUT2)
M2_OUT1: H6.1 U4.7(BOUT1)
M2_OUT2: H6.2 U4.5(BOUT2)
PWMH1_A: H?#2.2 U4.9(BIN1) ; port PWMH1_A
PWMH2_A: H?#1.2 U4.16(AIN1) ; port PWMH2_A
NetC20_1: C20.1 U4.11(VCP)
NetC22_2: C22.2 U4.14(VINT)
NetR11_1: R11.1 U4.12(VM)
NetU4_1: U4.1(nSLEEP) ; port nSLEEP
NetU4_8: U4.8(nFAULT) ; port nFAULT
NetU4_10: U4.10(BIN2) ; port PWMH1_B
NetU4_15: U4.15(AIN2) ; port PWMH2_B

### Notes on the sheet
- ESC Breakout
- (near U4) Check if external pulldown is needed
- Motor Connectors
- Title
- Drawn by:
- Date:
- Time:
- Revision:
- Sheet
- of
- File:

### Library data of the parts
C20 = CC_10nF_0603: CAP CER 10nF X7R +-10% 50V 0603; PackageReference: 0603; Code_IPC: 1608 [0603]; Verify: *; Supplier: ECE Dept; Storage Location: PCB Assembly WS; Value: 10nF
C21 = CC_10uF_0805_10V: as C16 on sheet Battery_and_Power; PackageReference: 0805; Code_IPC: 2012[0805]; Verify: *; Supplier: ECE Dept; Storage Location: PCB Assembly WS; Value: 10uF
C22 = CC_2.2uF_0603: CAP CER 2.2uF X5R +-20% 10V 0603; PackageReference: 0603; Code_IPC: 1608 [0603]; Verify: *; Supplier: ECE Dept; Storage Location: PCB Assembly WS; Value: 2.2uF
H5 H6 = TERM_BLK_2POS: 2 Position Terminal Block 7.62mm spacing
H?#1 H?#2 = HEADER_3: 3Pin Header 2.54mm spacing
R11 = RS_0R0: RES 0.0 OHM 1/10W 5% 0603 SMD; Storage Location: PCB Assembly WS; Supplier: ECE Dept; Value: 0R
U4 = DRV8833: Dual H-Bridge Motor Driver 1.5A

## Sheet Radio.SchDoc: Wacky Control Radio
size A3; Author: Josiah Craw; Address1: ECE Department; Address2: University of Canterbury; Address3: Christchurch 8041; Address4: New Zealand; Revision: 1
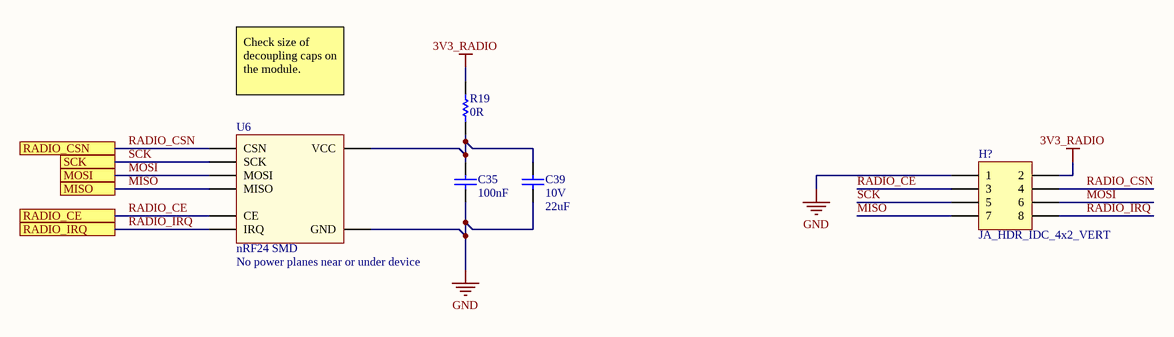
[diagram p5: Radio.SchDoc]

### Parts
(Parts that share a designator on the sheet are numbered #1, #2 ... from top to bottom, then left to right.)
C35  100nF  [CAPC1608L]
C39  Max Voltage: 10V  [CAPC3216L]  (hidden comment: 22uF)
H?#3  JA_HDR_IDC_4x2_VERT  [IDC2.54-V08D]
R19  0R  [RESC1608L]
U6  nRF24 SMD  Warning: No power planes near or under device  [NRF24]

### Ports
MISO, MOSI, RADIO_CE, RADIO_CSN, RADIO_IRQ, SCK

### Nets
3V3_RADIO: H?#3.2 R19.2
GND: C35.1 C39.1 H?#3.1 U6.2(GND)
MISO: H?#3.7 U6.7(MISO) ; port MISO
MOSI: H?#3.6 U6.6(MOSI) ; port MOSI
RADIO_CE: H?#3.3 U6.3(CE) ; port RADIO_CE
RADIO_CSN: H?#3.4 U6.4(CSN) ; port RADIO_CSN
RADIO_IRQ: H?#3.8 U6.8(IRQ) ; port RADIO_IRQ
SCK: H?#3.5 U6.5(SCK) ; port SCK
NetC35_2: C35.2 C39.2 R19.1 U6.1(VCC)

### Notes on the sheet
- Check size of decoupling caps on the module.
- Title
- Drawn by:
- Date:
- Time:
- Revision:
- Sheet
- of
- File:

### Library data of the parts
C35 = CC_100nF_0603: CAP CER 100nF X7R +-10% 50V 0603; PackageReference: 0603; Code_IPC: 1608 [0603]; Verify: *; Supplier: ECE Dept; Storage Location: PCB Assembly WS; Value: 100nF
C39 = CC_22uF_1206: CAP CER 22uF Y5V -20% +80% 10V 1206; Verify: *; Supplier: ECE Dept; Storage Location: PCB Assembly WS; Dielectric: Y5V; Footprint: 1206 (3216 metric); Value: 22uF
H?#3 = JA_HDR_IDC_4x2_VERT: IDC Header, 2.54mm, 8-Pin, Vert; Manufacturer: Amphenol FCI; Manufacturer Part Number: 75869-132LF; Number of Positions: 8; Max Voltage Rating (AC): 500V; Connector Type: Male Pin; Gender: Male; Current Rating: 3A; Row Spacing: 0.1inch; Mating Post Length: 6mm; Supplier 1: Digi-Key; Stock 1: 8776; Pricing 1: 1=0.76, 10=0.668, 100=0.5766, 500=0.47178, 1000=0.41936, 5000=0.36694, 10000=0.34859 (USD); Mount: Through Hole; Contact Material: Bronze; Contact Plating: Gold,GXT; Colour: Blue; Housing Colour: Blue; Housing Material: Thermoplastic; Min Operating Temperature: -65°C; Max Operating Temperature: 125°C; Number of Rows: 2; Packaging: Rail/Tube; Package Quantity: 100; Termination: Solder; Number of Contacts: 8; Orientation: Straight; Voltage Rating: 500V; Length: 17.37mm; Pitch: 2.54mm; Depth: 9.55mm; Termination Post Length: 3.05mm; Contact Mating Length: 0.236inch; Radiation Hardening: No; Lead Free: Lead Free; REACH SVHC: No SVHC; ComponentLink1URL: http://uk.rs-online.com/webdocs/13ec/0900766b813ecbbf.pdf; ComponentLink1Description: http://uk.rs-online.com/webdocs/13ec/0900766b813ecbbf.pdf; ComponentLink2URL: https://cdn.amphenol-icc.com/media/wysiwyg/files/drawing/75869.pdf; ComponentLink2Description: https://cdn.amphenol-icc.com/media/wysiwyg/files/drawing/75869.pdf; ComponentLink3URL: http://portal.fciconnect.com/Comergent/fci/drawing/75869.pdf; ComponentLink3Description: http://portal.fciconnect.com/Comergent/fci/drawing/75869.pdf; ComponentLink4URL: http://portal.fciconnect.com/Comergent//fci/drawing/75869.pdf; ComponentLink4Description: http://portal.fciconnect.com/Comergent//fci/drawing/75869.pdf; Supplier Part Number 1: 609-3530-ND
R19 = RS_0R0: RES 0.0 OHM 1/10W 5% 0603 SMD; Storage Location: PCB Assembly WS; Supplier: ECE Dept; Value: 0R
U6 = NRF24: nRF24 SMD Module

## Sheet Joystick.SchDoc: Joystick (Wacky Races)
size A3; Author: Harry Dobbs; Address1: ECE Department; Address2: University of Canterbury; Address3: Christchurch 8041; Address4: New Zealand; Revision: 1
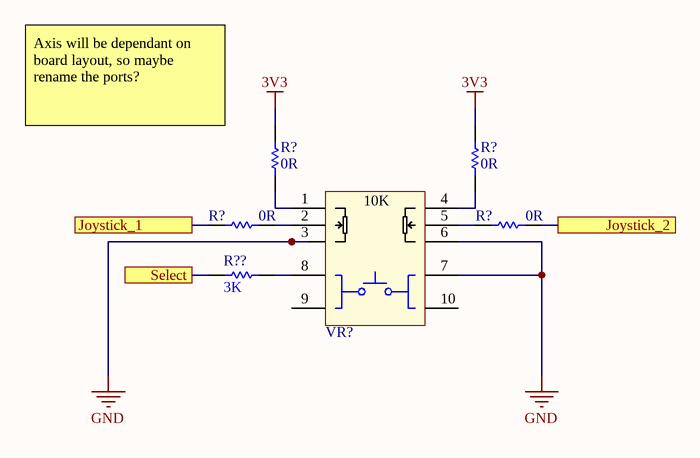
[diagram p6: Joystick.SchDoc]

### Parts
(Parts that share a designator on the sheet are numbered #1, #2 ... from top to bottom, then left to right.)
R?#1  0R  [RESC1608L]
R?#2  0R  [RESC1608L]
R?#3  0R  [RESC1608L]
R?#4  0R  [RESC1608L]
R??#4  3K  [RESC1608L]
VR?  Joystick 10k with Sw  [Joystick_Sw]  (value not drawn)

### Ports
Joystick_1, Joystick_2, Select

### Nets
3V3: R?#1.2 R?#2.2
GND: VR?.3 VR?.6(3') VR?.7
NetR?#1_1: R?#1.1 VR?.1
NetR?#2_1: R?#2.1 VR?.4(1')
NetR?#3_1: R?#3.1 ; port Joystick_1
NetR?#3_2: R?#3.2 VR?.2
NetR?#4_1: R?#4.1 VR?.5(2')
NetR?#4_2: R?#4.2 ; port Joystick_2
NetR??#4_1: R??#4.1 ; port Select
NetR??#4_2: R??#4.2 VR?.8

Not connected (* = marked no-connect by the designer): VR? 9 10

### Notes on the sheet
- (near R?#1) Axis will be dependant on board layout, so maybe rename the ports?
- Title
- Drawn by:
- Date:
- Time:
- Revision:
- Sheet
- of
- File:
- (in symbol Joystick 10k with Sw) 10K

### Library data of the parts
R?#1-R?#4 = RS_0R0: RES 0.0 OHM 1/10W 5% 0603 SMD; Storage Location: PCB Assembly WS; Supplier: ECE Dept; Value: 0R
R??#4 = RS_3K: RES 3K OHM 1/10W 5% 0603 SMD; Storage Location: PCB Assembly WS; Supplier: ECE Dept; Value: 3K
VR? = Joystick 10k with Sw: JOYSTICK 10K OHM 2 AXIS TH; Manufacturer 1: SparkFun; Manufacturer Part Number 1: COM-09032; Supplier 1: Digi-Key; Stock 1: 563; Pricing 1: 1=3.95000 (USD); RoHS: No; ComponentLink1URL: https://media.digikey.com/pdf/Data%20Sheets/Sparkfun%20PDFs/COM-09032_Web.pdf?src-supplier=Digi-Key; ComponentLink1Description: https://media.digikey.com/pdf/Data%20Sheets/Sparkfun%20PDFs/COM-09032_Web.pdf?src-supplier=Digi-Key; Supplier Part Number 1: 1568-1526-ND

## Nets that join several sheets
3V3: SAM4S_MCU (16 pins), IMU_MPU-9250 (R17.2), Battery_and_Power (C31.2 S3.7 S3.8), Joystick (R?#1.2 R?#2.2)
3V3_PROG: SAM4S_MCU (H2.7 H2.8), Battery_and_Power (S3.2)
3V3_RADIO: Battery_and_Power (C34.2 U7.5), Radio (H?#3.2 R19.2)
5V: SAM4S_MCU (5 pins), Battery_and_Power (8 pins)
GND: SAM4S_MCU (38 pins), IMU_MPU-9250 (8 pins), Battery_and_Power (20 pins), Motor_Drivers (8 pins), Radio (C35.1 C39.1 H?#3.1 U6.2), Joystick (VR?.3 VR?.6 VR?.7)
VBAT: Battery_and_Power (C16.2 F2.1 Q1.2 U3.3), Motor_Drivers (5 pins)
VBAT_RAW: SAM4S_MCU (R9.2), Battery_and_Power (F1.2 Q1.3)
VBUS: SAM4S_MCU (H1.1 R1.2), Battery_and_Power (S3.4)